# EAGLE design microSD_Shield (EAGLE 6.5.0)
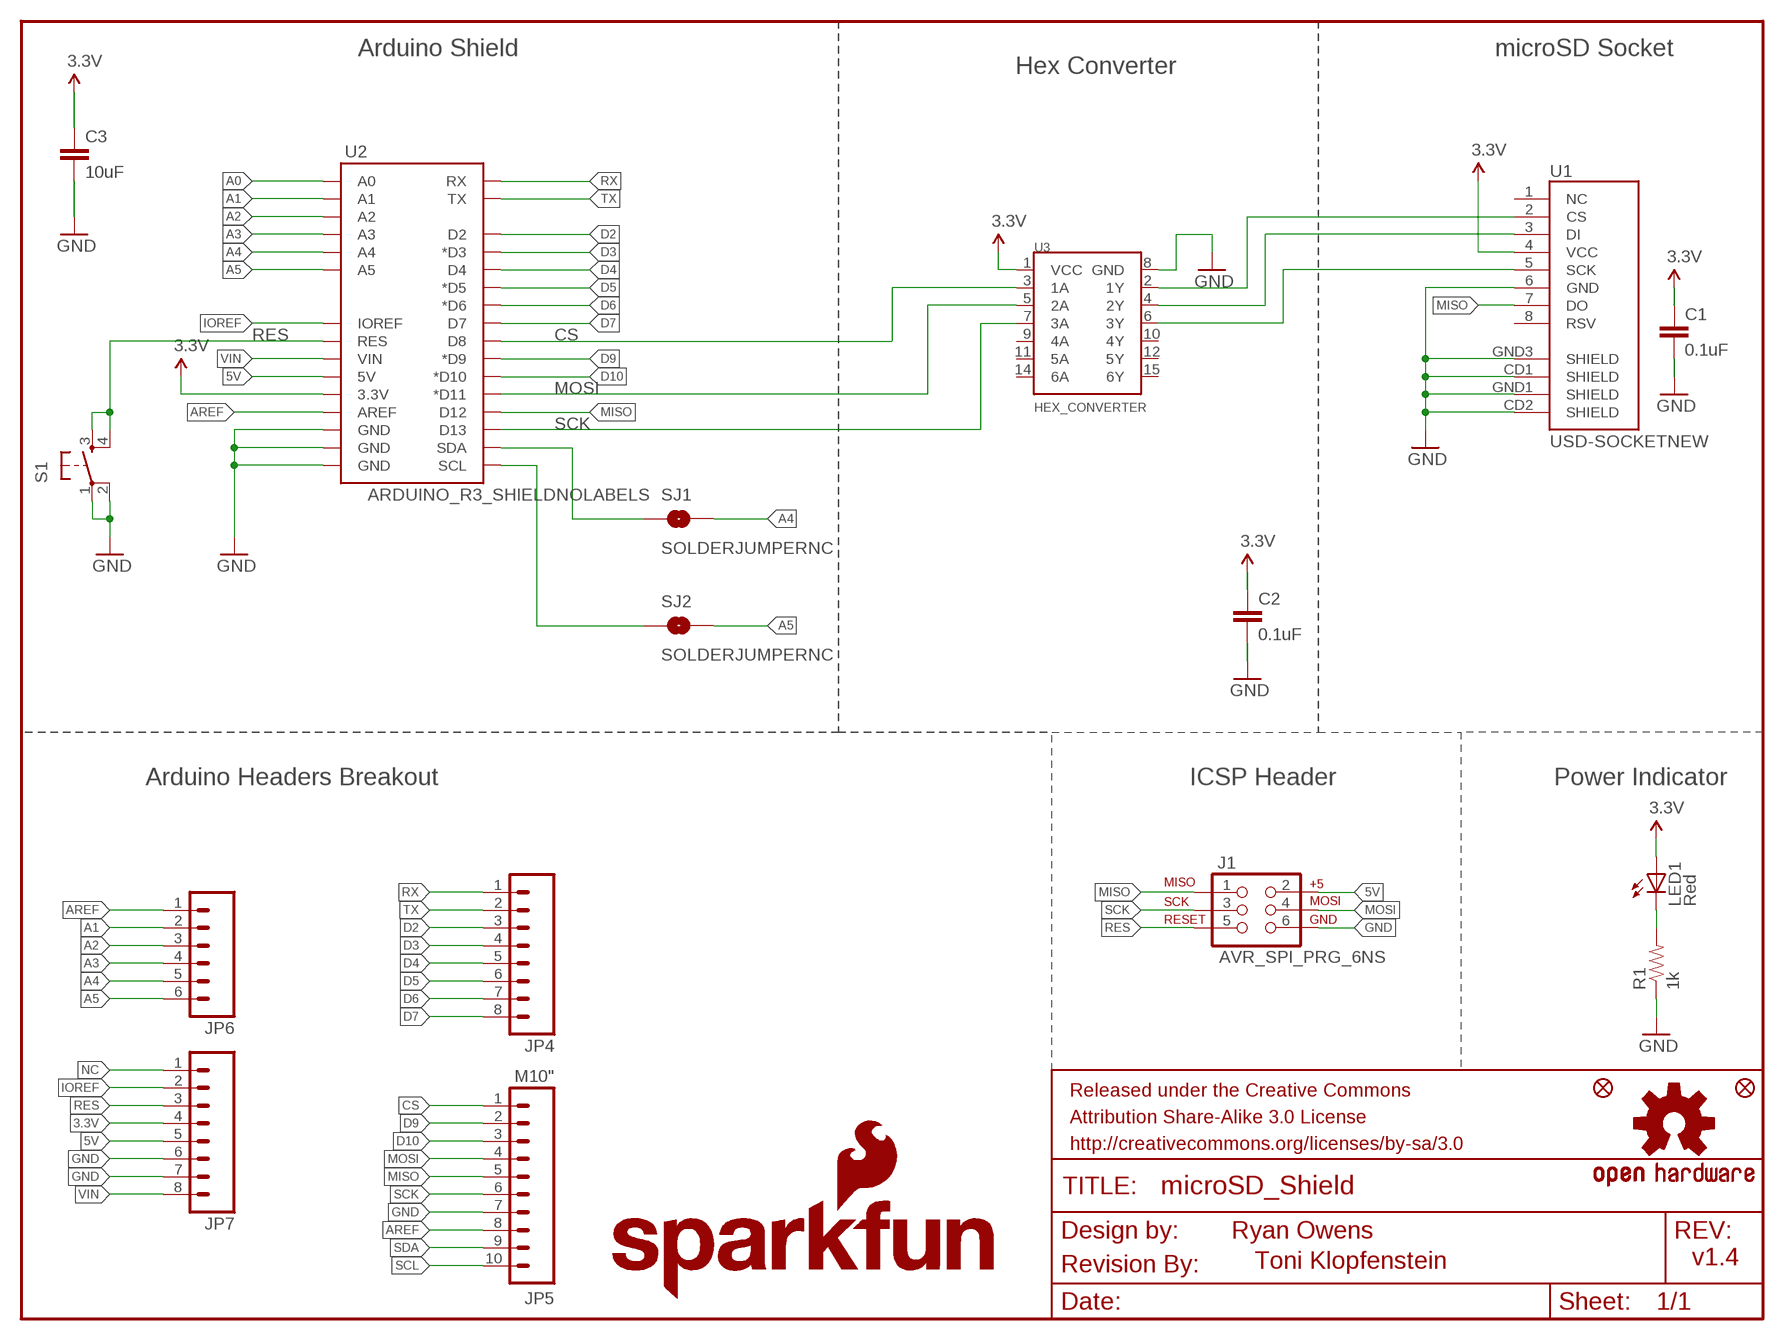
[diagram p0: schematic, sheet 1]

## Parts
C1  0.1uF  0.1UF-25V-5%(0603)  [0603-CAP]
C2  0.1uF  0.1UF-25V-5%(0603)  [0603-CAP]
C3  10uF  10UF-6.3V-20%(0603)  [0603-CAP]
FRAME1  FRAME-LETTER  [CREATIVE_COMMONS]
J1  AVR_SPI_PRG_6NS  [2X3-NS]
JP1  SFE_LOGO_NAME_FLAME.1_INCH  [SFE_LOGO_NAME_FLAME_.1]
JP2  FIDUCIAL1X2  [FIDUCIAL-1X2]
JP3  FIDUCIAL1X2  [FIDUCIAL-1X2]
JP4  M08  [1X08]
JP5  M10"  [1X10]
JP6  M06SIP  [1X06]
JP7  M081X08  [1X08]
LED1  Red  LED0603  [LED-0603]
LOGO1  OSHW-LOGOM  [OSHW-LOGO-M]
LOGO2  SFE_LOGO_FLAME.6_INCH  [SFE_LOGO_FLAME_.6]
R1  1k  RESISTOR0603-RES  [0603-RES]
S1  TAC_SWITCHSMD  [TACTILE_SWITCH_SMD]
SJ1  SOLDERJUMPERNC  [SJ_2S]
SJ2  SOLDERJUMPERNC  [SJ_2S]
U1  USD-SOCKETNEW  [MICRO-SD-SOCKET-PP]
U2  ARDUINO_R3_SHIELDNOLABELS  [UNO_R3_SHIELD_NOLABELS]
U3  HEX_CONVERTER  [SO016]
U$1  REVISION  [REVISION]

## Nets
3.3V: C1.1 C2.1 C3.1 JP7.4 LED1.A U1.4(VCC) U2.3.3V U3.1(VCC)
5V: J1.2 JP7.5 U2.5V
A0: JP6.1 U2.A0
A1: JP6.2 U2.A1
A2: JP6.3 U2.A2
A3: JP6.4 U2.A3
A4: JP6.5 SJ1.2 U2.A4
A5: JP6.6 SJ2.2 U2.A5
AREF: JP5.8 U2.AREF
CS: JP5.1 U2.D8 U3.3(1A)
D2: JP4.3 U2.D2
D3: JP4.4 U2.D3(*D3)
D4: JP4.5 U2.D4
D5: JP4.6 U2.D5(*D5)
D6: JP4.7 U2.D6(*D6)
D7: JP4.8 U2.D7
D9: JP5.2 U2.D9(*D9)
D10: JP5.3 U2.D10(*D10)
GND: C1.2 C2.2 C3.2 J1.6 JP5.7 JP7.6 JP7.7 R1.1 S1.1 S1.2 U1.6(GND) U1.CD1(SHIELD) U1.CD2(SHIELD) U1.GND1(SHIELD) U1.GND3(SHIELD) U2.GND@0(GND) U2.GND@1(GND) U2.GND@2(GND) U3.8(GND)
IOREF: JP7.2 U2.IOREF
MISO: J1.1 JP5.5 U1.7(DO) U2.D12
MOSI: J1.4 JP5.4 U2.D11(*D11) U3.5(2A)
N$2: U1.3(DI) U3.4(2Y)
N$4: U1.5(SCK) U3.6(3Y)
N$6: LED1.C R1.2
N$163: U1.2(CS) U3.2(1Y)
NC: JP7.1
RES: J1.5 JP7.3 S1.3 S1.4 U2.RES
RX: JP4.1 U2.RX
SCK: J1.3 JP5.6 U2.D13 U3.7(3A)
SCL: JP5.10 SJ2.1 U2.SCL
SDA: JP5.9 SJ1.1 U2.SDA
TX: JP4.2 U2.TX
VIN: JP7.8 U2.VIN
Unconnected: U1.1(NC) U1.8(RSV) U3.9(4A) U3.10(4Y) U3.11(5A) U3.12(5Y) U3.14(6A) U3.15(6Y)

## Notes on the sheet
- Arduino Shield | microSD Socket
- Hex Converter
- ICSP Header | Power Indicator
- Arduino Headers Breakout
- Ryan Owens
- Toni Klopfenstein | v1.4

## Library data of the parts
C1 C2 = SparkFun-Capacitors:0.1UF-25V-5%(0603): CAP-08604; PROD_ID: CAP-08604
C3 = SparkFun-Capacitors:10UF-6.3V-20%(0603): CAP-11015; PROD_ID: CAP-11015
FRAME1 = SparkFun-Aesthetics:FRAME-LETTER: Schematic Frame Standard 8.5x11 US Letter frame
J1 = SparkFun-Connectors:AVR_SPI_PRG_6: AVR ISP 6 Pin This is the reduced ISP connector for AVR programming. Common on Arduino. This footprint will take up less PCB space and can be used with a 10-pin to 6-pin adapter such as SKU: BOB-08508
JP1 = SparkFun-Aesthetics:SFE_LOGO_NAME_FLAME: SFE Logo, name and flame This is the SparkFun full logo. The logo on the schematic will always be the same size; the package variant is the height of the flame part of the logo. Default layer for the logo on the board is tSilk.
JP2 JP3 = SparkFun-Aesthetics:FIDUCIAL: Fiducial Alignment Points Various fiducial points for machine vision alignment.
JP4 = SparkFun:M08: Header 8 Standard 8-pin 0.1" header. Use with straight break away headers (SKU : PRT-00116), right angle break away headers (PRT-00553), swiss pins (PRT-00743), machine pins (PRT-00117), and female headers (PRT-00115).
JP5 = SparkFun-Connectors:M10: Header 10 Standard 10-pin 0.1" header. Use with straight break away headers (SKU : PRT-00116), right angle break away headers (PRT-00553), swiss pins (PRT-00743), machine pins (PRT-00117), and female headers (PRT-00115).
JP6 = SparkFun:M06: Header 6 Standard 6-pin 0.1" header. Use with straight break away headers (SKU : PRT-00116), right angle break away headers (PRT-00553), swiss pins (PRT-00743), machine pins (PRT-00117), and female headers (PRT-00115). Molex polarized connector foot print use with SKU : PRT-08094 with associated crimp pins and housings. NOTES ON THE VARIANTS LOCK and LOCK_LONGPADS... This footprint was designed to help hold the alignment of a through-hole component (i.e. 6-pin header) while soldering it into place. You may notice that each hole has been shifted either up or down by 0.005 of an inch from it's more standard position (which is a perfectly straight line). This slight alteration caused the pins (the squares in the middle) to touch the edges of the holes. Because they are alternating, it causes a "brace" to hold the component in place. 0.005 has proven to be the perfect amount of "off-center" position when using our standard breakaway headers. Although looks a little odd when you look at the bare footprint, once you have a header in there, the alteration is very hard to notice. Also, if you push a header all the way into place, it is covered up entirely on the bottom side. This idea of altering the position of holes to aid alignment will be further integrated into the Sparkfun Library for other footprints. It can help hold any component with 3 or more connection pins.
JP7 = SparkFun-Connectors:M08: Header 8 Standard 8-pin 0.1" header. Use with straight break away headers (SKU : PRT-00116), right angle break away headers (PRT-00553), swiss pins (PRT-00743), machine pins (PRT-00117), and female headers (PRT-00115).
LED1 = SparkFun:LED: LEDs Standard schematic elements and footprints for 5mm, 3mm, 1206, and 0603 sized LEDs. 5mm - Spark Fun Electronics SKU : COM-00529 (and others)
LOGO1 = SparkFun-Aesthetics:OSHW-LOGO: Open Source Hardware Logo This logo indicates the piece of hardware it is found on incorporates a OSHW license and/or adheres to the definition of open source hardware found here: http://freedomdefined.org/OSHW
LOGO2 = SparkFun-Aesthetics:SFE_LOGO_FLAME: SFE Logo, flame only This is the SparkFun flame logo. The logo on the schematic will always be the same size; the package variant is the height of the flame. Default layer for the logo on the board is tSilk.
R1 = SparkFun:RESISTOR: Resistor Basic schematic elements and footprints for 0603, 1206, and PTH 1/10th watt (small) resistors.
S1 = SparkFun:TAC_SWITCH: Momentary Switch Button commonly used for reset or general input. Spark Fun Electronics SKU : COM-00097
SJ1 SJ2 = SparkFun-Passives:SOLDERJUMPER: Solder Jumper Standard SMD solder jumper. Used to automate production. Two varients : Normally Open and Normally Closed are the same, but have different paste layers. NC will have a large amount of paste and should jumper during reflow.
U1 = SparkFun:USD-SOCKET: microSD Socket Push-push type uSD socket. Schematic element and footprint production proven. Spark Fun Electronics SKU : PRT-00127. tDoc lines correctly indicate media card edge positions when inserting (unlocked, locked, depressed).
U2 = SparkFun-Boards:ARDUINO_R3_SHIELD: Shield form compatible with the Arduino Uno R3.
U3 = SparkFun:HEX_CONVERTER
U$1 = SparkFun-Aesthetics:REVISION

## Board
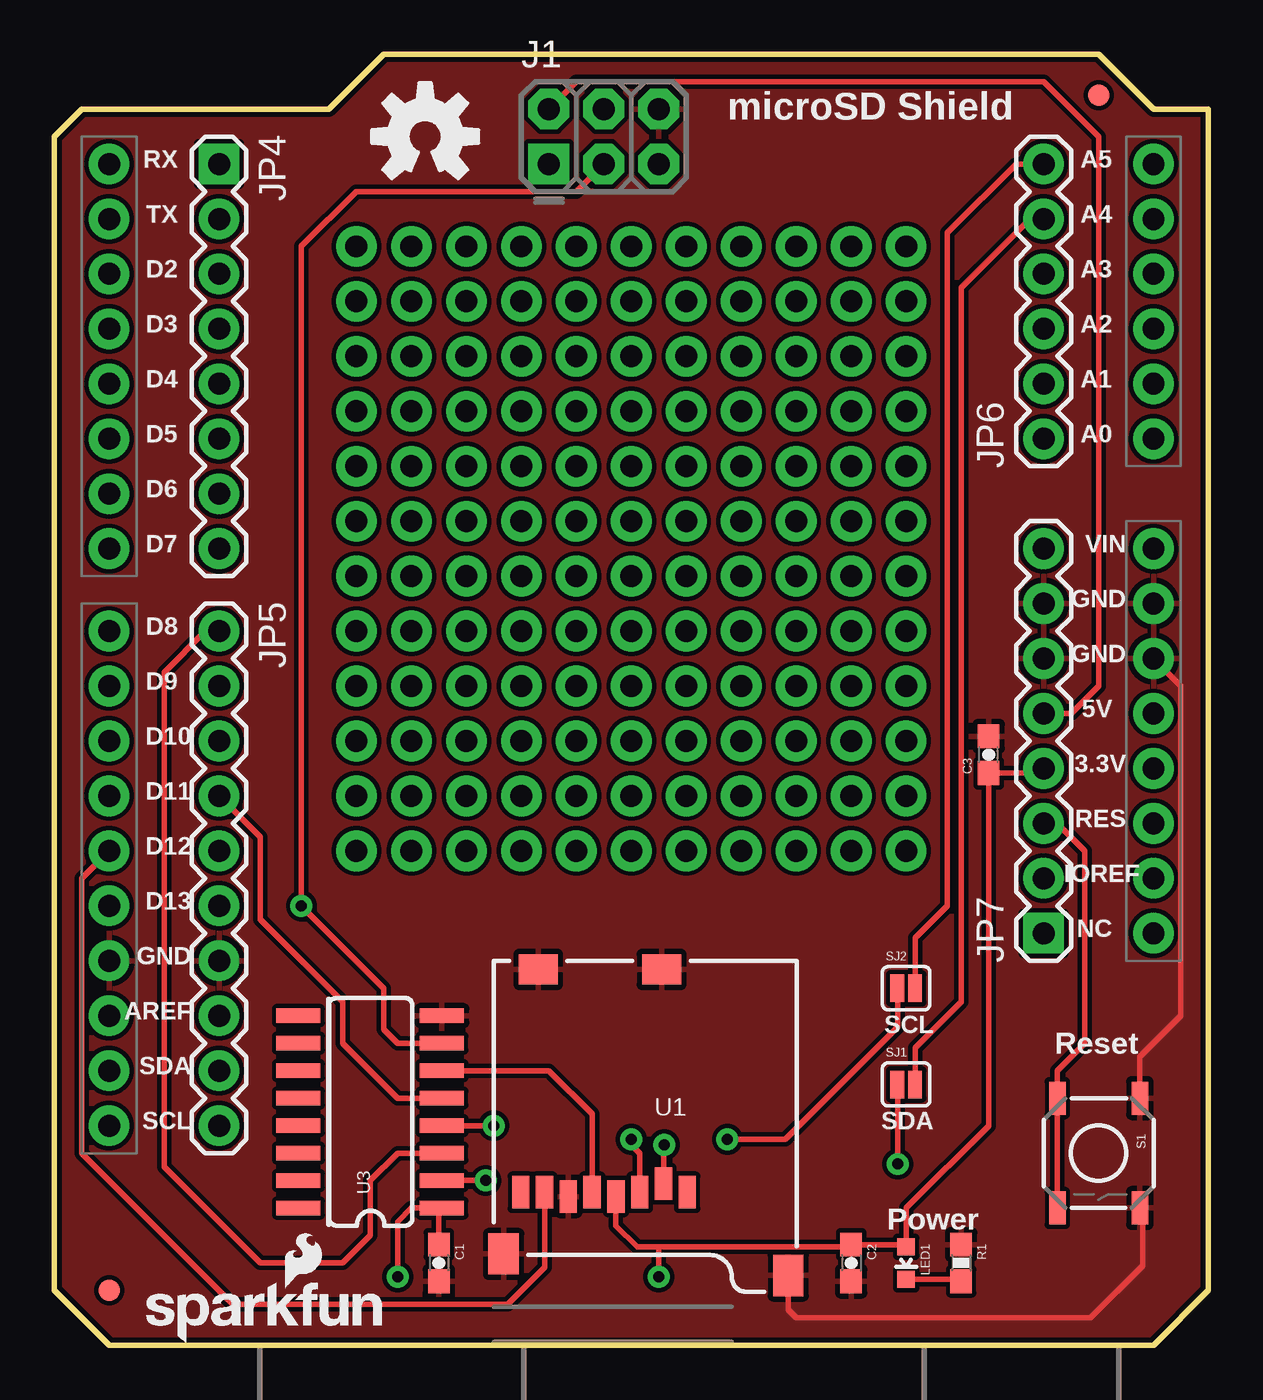
[diagram p1: board, top side]
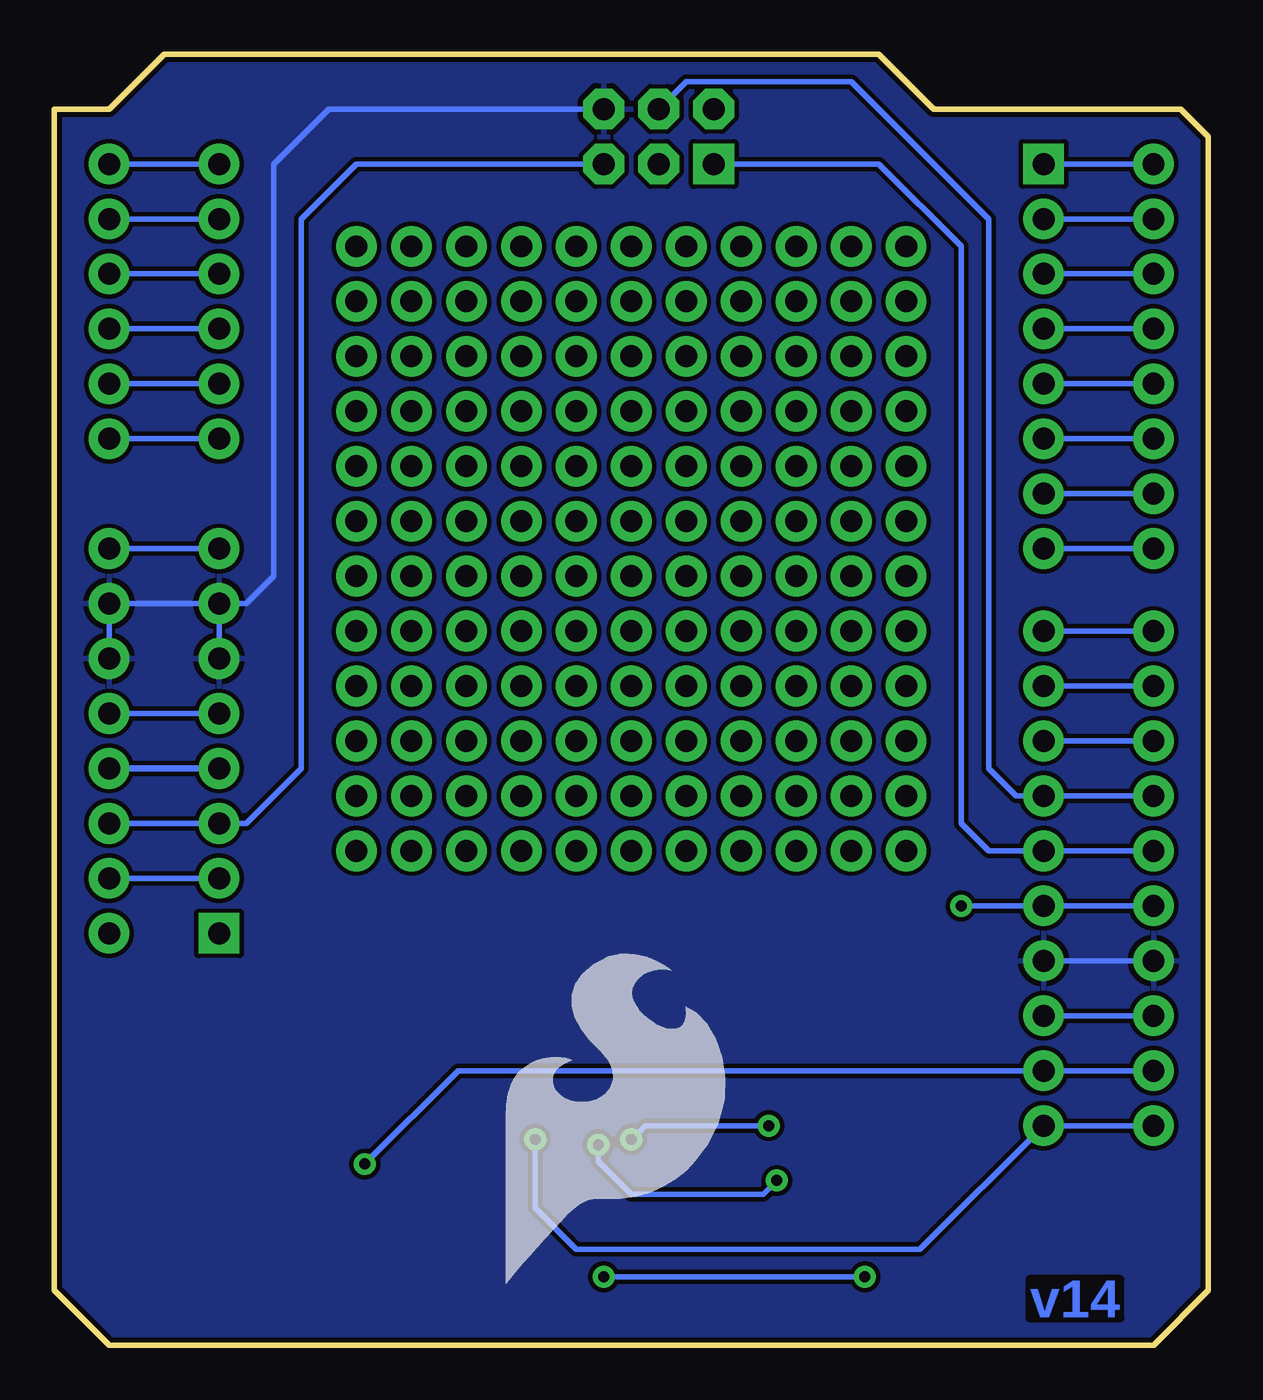
[diagram p2: board, bottom side, seen from below]

Size 53.34 x 59.69 mm. Coordinates in mm from the lower left corner, seen from the top.
Outline: 0,2.54 0,55.88 1.27,57.15 12.7,57.15 15.24,59.69 48.26,59.69 50.8,57.15 53.34,57.15 53.34,2.54 50.8,0 2.54,0 0,2.54
Copper layers (1*16): Top 0.035mm / dielectric 1.5mm / Bottom 0.035mm
Design rules "SparkFun *": minimum track width 8mil, minimum drill 20mil, track to track 8mil, track to pad 8mil, pad to pad 8mil, via to via 8mil, smd to smd 8mil, copper to edge 9mil, drill to drill 8mil, minimum pad ring 12mil, minimum via ring 10mil, stop-mask expansion 4mil, vias tented up to drill 20mil, thermal gap 10mil

### Footprints (pad centres in the part's own frame; a part is rotated, then mirrored left to right if it is on the bottom)
0603-CAP = smd 1.1 x 1: 1 -0.85,0; 2 0.85,0
2X3-NS = drill 1.016 pad 1.88 square: 1 -2.54,-1.27 | drill 1.016 pad 1.88 octagon: 2 -2.54,1.27; 3 0,-1.27; 4 0,1.27; 5 2.54,-1.27; 6 2.54,1.27
FIDUCIAL-1X2 = smd 1 x 1: 1 0,0
1X08 = drill 1.016 pad 1.88 square: 1 0,0 | drill 1.016 pad 1.88: 2 2.54,0; 3 5.08,0; 4 7.62,0; 5 10.16,0; 6 12.7,0; 7 15.24,0; 8 17.78,0
1X10 = drill 1.016 pad 1.88: 1 0,0; 2 2.54,0; 3 5.08,0; 4 7.62,0; 5 10.16,0; 6 12.7,0; 7 15.24,0; 8 17.78,0; 9 20.32,0; 10 22.86,0
1X06 = drill 1.016 pad 1.88: 1 0,0; 2 2.54,0; 3 5.08,0; 4 7.62,0; 5 10.16,0; 6 12.7,0
LED-0603 = smd 0.8 x 0.8: A 0,-0.75; C 0,0.75
0603-RES = smd 1.1 x 1: 1 -0.85,0; 2 0.85,0
TACTILE_SWITCH_SMD = smd 1.524 x 0.762: 1 -2.54,1.905; 2 2.54,1.905; 3 -2.54,-1.905; 4 2.54,-1.905
SJ_2S = smd 0.635 x 1.27: 1 -0.412,0; 2 0.412,0
MICRO-SD-SOCKET-PP = smd 0.8 x 1.5: 1 -8.94,10.7; 2 -7.84,10.3; 3 -6.74,10.7; 4 -5.64,10.9; 5 -4.54,10.7; 6 -3.44,10.9; 7 -2.34,10.7; 8 -1.24,10.7 | smd 1.8 x 1.4: CD1 -2.05,0.4; CD2 -7.75,0.4 | smd 1.4 x 1.9: GND1 -13.6,14.55; GND3 -0.45,13.55
UNO_R3_SHIELD_NOLABELS = drill 1.016 pad 1.88: 3.3V 50.8,26.67; 5V 50.8,29.21; A0 50.8,41.91; A1 50.8,44.45; A2 50.8,46.99; A3 50.8,49.53; A4 50.8,52.07; A5 50.8,54.61; AREF 2.54,15.24; D2 2.54,49.53; D3 2.54,46.99; D4 2.54,44.45; D5 2.54,41.91; D6 2.54,39.37; D7 2.54,36.83; D8 2.54,33.02; D9 2.54,30.48; D10 2.54,27.94; D11 2.54,25.4; D12 2.54,22.86; D13 2.54,20.32; GND@0 50.8,31.75; GND@1 50.8,34.29; GND@2 2.54,17.78; IOREF 50.8,21.59; NC 50.8,19.05; RES 50.8,24.13; RX 2.54,54.61; SCL 2.54,10.16; SDA 2.54,12.7; TX 2.54,52.07; VIN 50.8,36.83
SO016 = smd 0.66 x 2.032: 1 -4.445,-3.315; 2 -3.175,-3.315; 3 -1.905,-3.315; 4 -0.635,-3.315; 5 0.635,-3.315; 6 1.905,-3.315; 7 3.175,-3.315; 8 4.445,-3.315; 9 4.445,3.315; 10 3.175,3.315; 11 1.905,3.315; 12 0.635,3.315; 13 -0.635,3.315; 14 -1.905,3.315; 15 -3.175,3.315; 16 -4.445,3.315

### Placement (x,y rotation side)
C1  17.78,3.81 270 top
C2  36.83,3.81 270 top
C3  43.18,27.3 90 top
FRAME1  -5.82,-25.4 0 top  (outside the outline)
J1  25.4,55.88 0 top
JP1  3.81,0 0 top
JP2  48.26,57.78 0 top
JP3  2.54,2.54 0 top
JP4  7.62,54.61 270 top
JP5  7.62,33.02 270 top
JP6  45.72,41.91 90 top
JP7  45.72,19.05 90 top
LED1  39.37,3.81 180 top
LOGO1  17.14,55.88 0 top
LOGO2  33.02,2.54 0 bottom
R1  41.91,3.81 270 top
S1  48.26,8.89 270 top
SJ1  39.37,12.06 0 top
SJ2  39.37,16.51 0 top
U1  20.32,17.78 180 top
U2  0,0 0 top
U3  14.61,10.79 90 top
U$1  5.08,-27.94 0 top  (outside the outline)

### Tracks (layer width: path | path; a pad name or v marks a point on that pad's centre or on a via)
3.3V  (via drill 0.51)
  Top 0.254: U1.4 25.96,5.54 26.94,4.56 27.94,4.56 | v15.88,3.17 15.88,5.71 16.51,6.35 U3.1 17.78,6.21 C1.1 | v27.94,3.17 27.94,4.56 | 27.94,4.56 36.73,4.56 C2.1 39.27,4.66 LED1.A 39.37,6.35 43.18,10.16 C3.1 45.51,26.45 JP7.4
  Bottom 0.254: v15.88,3.17 v27.94,3.17
  Bottom 0.305: JP7.4 U2.3.3V
5V
  Top 0.254: JP7.5 46.99,29.21 48.26,30.48 48.26,55.88 45.72,58.42 24.13,58.42 J1.2
  Bottom 0.254: JP7.5 U2.5V
A0
  Bottom 0.254: JP6.1 U2.A0
A1
  Bottom 0.254: JP6.2 U2.A1
A2
  Bottom 0.254: JP6.3 U2.A2
A3
  Bottom 0.254: JP6.4 U2.A3
A4
  Top 0.254: SJ1.2 39.78,13.75 41.91,15.88 41.91,48.9 45.09,52.07 JP6.5
  Bottom 0.254: JP6.5 U2.A4
A5
  Top 0.254: JP6.6 44.45,54.61 41.28,51.44 41.28,20.32 39.78,18.83 SJ2.2
  Bottom 0.254: JP6.6 U2.A5
AREF
  Bottom 0.254: U2.AREF JP5.8
CS
  Top 0.254: JP5.1 6.98,33.02 5.08,31.11 5.08,8.26 9.53,3.81 10.16,3.81 10.79,3.81 13.33,3.81 14.61,5.08 14.61,7.62 15.88,8.89 U3.3
  Bottom 0.254: U2.D8 JP5.1
D2
  Bottom 0.254: U2.D2 JP4.3
D3
  Bottom 0.254: U2.D3 JP4.4
D4
  Bottom 0.254: U2.D4 JP4.5
D5
  Bottom 0.254: U2.D5 JP4.6
D6
  Bottom 0.254: U2.D6 JP4.7
D7
  Bottom 0.254: U2.D7 JP4.8
D9
  Bottom 0.254: U2.D9 JP5.2
D10
  Bottom 0.254: U2.D10 JP5.3
GND
  Top 0.254: U2.GND@0 52.07,30.48 52.07,15.24 50.17,13.34 S1.1 | U1.GND1 33.92,1.64 34.29,1.27 47.88,1.27 50.29,3.68 50.29,6.22 S1.2
  Bottom 0.254: U2.GND@0 U2.GND@1 46.36,34.29 | J1.6 40.64,57.15 43.18,54.61 43.18,35.56 44.45,34.29 JP7.7 46.36,34.29 | U2.GND@2 JP5.7 | JP7.6 45.72,33.66 46.36,34.29
  pour Bottom: 2.54,0 0,2.54 0,55.88 1.27,57.15 12.7,57.15 15.24,59.69 48.26,59.69 50.8,57.15 53.34,57.15 53.34,2.54 50.8,0
  pour Top: 2.54,0 0,2.54 0,55.88 1.27,57.15 12.7,57.15 15.24,59.69 48.26,59.69 50.8,57.15 53.34,57.15 53.34,2.54 50.8,0
IOREF
  Bottom 0.254: JP7.2 U2.IOREF
MISO
  Top 0.254: U1.7 22.66,3.61 20.95,1.91 8.26,1.91 1.27,8.89 1.27,21.59 U2.D12
  Bottom 0.254: JP5.5 U2.D12 10.16,22.86 11.43,24.13 11.43,50.8 15.24,54.61 J1.1
MOSI
  Top 0.254: U3.5 15.88,11.43 13.33,13.97 13.33,15.88 9.53,19.68 9.53,23.5 JP5.4
  Bottom 0.254: J1.4 24.13,58.42 16.51,58.42 10.16,52.07 10.16,26.67 8.89,25.4 JP5.4 U2.D11
N$2  (via drill 0.51)
  Top 0.254: U3.4 v20.32,10.16 | v26.67,9.53 26.67,9.27 27.05,8.89 U1.3
  Bottom 0.254: v20.32,10.16 26.04,10.16 v26.67,9.53
N$4
  Top 0.254: U3.6 22.86,12.7 24.86,10.7 U1.5
N$6
  Top 0.254: LED1.C 41.81,3.06 R1.2
N$7  (via drill 1.02 pad 1.88)
  other vias: 39.37,50.8
N$9  (via drill 1.02 pad 1.88)
  other vias: 36.83,50.8
N$10  (via drill 1.02 pad 1.88)
  other vias: 34.29,50.8
N$11  (via drill 1.02 pad 1.88)
  other vias: 31.75,50.8
N$12  (via drill 1.02 pad 1.88)
  other vias: 29.21,50.8
N$13  (via drill 1.02 pad 1.88)
  other vias: 26.67,50.8
N$14  (via drill 1.02 pad 1.88)
  other vias: 24.13,50.8
N$15  (via drill 1.02 pad 1.88)
  other vias: 21.59,50.8
N$16  (via drill 1.02 pad 1.88)
  other vias: 19.05,50.8
N$17  (via drill 1.02 pad 1.88)
  other vias: 16.51,50.8
N$18  (via drill 1.02 pad 1.88)
  other vias: 13.97,50.8
N$21  (via drill 1.02 pad 1.88)
  other vias: 13.97,48.26
N$22  (via drill 1.02 pad 1.88)
  other vias: 16.51,48.26
N$23  (via drill 1.02 pad 1.88)
  other vias: 19.05,48.26
N$24  (via drill 1.02 pad 1.88)
  other vias: 21.59,48.26
N$25  (via drill 1.02 pad 1.88)
  other vias: 24.13,48.26
N$26  (via drill 1.02 pad 1.88)
  other vias: 26.67,48.26
N$27  (via drill 1.02 pad 1.88)
  other vias: 29.21,48.26
N$28  (via drill 1.02 pad 1.88)
  other vias: 31.75,48.26
N$29  (via drill 1.02 pad 1.88)
  other vias: 34.29,48.26
N$30  (via drill 1.02 pad 1.88)
  other vias: 36.83,48.26
N$31  (via drill 1.02 pad 1.88)
  other vias: 39.37,48.26
N$34  (via drill 1.02 pad 1.88)
  other vias: 39.37,45.72
N$35  (via drill 1.02 pad 1.88)
  other vias: 36.83,45.72
N$36  (via drill 1.02 pad 1.88)
  other vias: 34.29,45.72
N$37  (via drill 1.02 pad 1.88)
  other vias: 31.75,45.72
N$38  (via drill 1.02 pad 1.88)
  other vias: 29.21,45.72
N$39  (via drill 1.02 pad 1.88)
  other vias: 26.67,45.72
N$40  (via drill 1.02 pad 1.88)
  other vias: 24.13,45.72
N$41  (via drill 1.02 pad 1.88)
  other vias: 21.59,45.72
N$42  (via drill 1.02 pad 1.88)
  other vias: 19.05,45.72
N$43  (via drill 1.02 pad 1.88)
  other vias: 16.51,45.72
N$44  (via drill 1.02 pad 1.88)
  other vias: 13.97,45.72
N$47  (via drill 1.02 pad 1.88)
  other vias: 13.97,43.18
N$48  (via drill 1.02 pad 1.88)
  other vias: 16.51,43.18
N$49  (via drill 1.02 pad 1.88)
  other vias: 19.05,43.18
N$50  (via drill 1.02 pad 1.88)
  other vias: 21.59,43.18
N$51  (via drill 1.02 pad 1.88)
  other vias: 24.13,43.18
N$52  (via drill 1.02 pad 1.88)
  other vias: 26.67,43.18
N$53  (via drill 1.02 pad 1.88)
  other vias: 29.21,43.18
N$54  (via drill 1.02 pad 1.88)
  other vias: 31.75,43.18
N$55  (via drill 1.02 pad 1.88)
  other vias: 34.29,43.18
N$56  (via drill 1.02 pad 1.88)
  other vias: 36.83,43.18
N$57  (via drill 1.02 pad 1.88)
  other vias: 39.37,43.18
N$60  (via drill 1.02 pad 1.88)
  other vias: 39.37,40.64
N$61  (via drill 1.02 pad 1.88)
  other vias: 36.83,40.64
N$62  (via drill 1.02 pad 1.88)
  other vias: 34.29,40.64
N$63  (via drill 1.02 pad 1.88)
  other vias: 31.75,40.64
N$64  (via drill 1.02 pad 1.88)
  other vias: 29.21,40.64
N$65  (via drill 1.02 pad 1.88)
  other vias: 26.67,40.64
N$66  (via drill 1.02 pad 1.88)
  other vias: 24.13,40.64
N$67  (via drill 1.02 pad 1.88)
  other vias: 21.59,40.64
N$68  (via drill 1.02 pad 1.88)
  other vias: 19.05,40.64
N$69  (via drill 1.02 pad 1.88)
  other vias: 16.51,40.64
N$70  (via drill 1.02 pad 1.88)
  other vias: 13.97,40.64
N$73  (via drill 1.02 pad 1.88)
  other vias: 13.97,38.1
N$74  (via drill 1.02 pad 1.88)
  other vias: 16.51,38.1
N$75  (via drill 1.02 pad 1.88)
  other vias: 19.05,38.1
N$76  (via drill 1.02 pad 1.88)
  other vias: 21.59,38.1
N$77  (via drill 1.02 pad 1.88)
  other vias: 24.13,38.1
N$78  (via drill 1.02 pad 1.88)
  other vias: 26.67,38.1
N$79  (via drill 1.02 pad 1.88)
  other vias: 29.21,38.1
N$80  (via drill 1.02 pad 1.88)
  other vias: 31.75,38.1
N$81  (via drill 1.02 pad 1.88)
  other vias: 34.29,38.1
N$82  (via drill 1.02 pad 1.88)
  other vias: 36.83,38.1
N$83  (via drill 1.02 pad 1.88)
  other vias: 39.37,38.1
N$86  (via drill 1.02 pad 1.88)
  other vias: 39.37,35.56
N$87  (via drill 1.02 pad 1.88)
  other vias: 36.83,35.56
N$88  (via drill 1.02 pad 1.88)
  other vias: 34.29,35.56
N$89  (via drill 1.02 pad 1.88)
  other vias: 31.75,35.56
N$90  (via drill 1.02 pad 1.88)
  other vias: 29.21,35.56
N$91  (via drill 1.02 pad 1.88)
  other vias: 26.67,35.56
N$92  (via drill 1.02 pad 1.88)
  other vias: 24.13,35.56
N$93  (via drill 1.02 pad 1.88)
  other vias: 21.59,35.56
N$94  (via drill 1.02 pad 1.88)
  other vias: 19.05,35.56
N$95  (via drill 1.02 pad 1.88)
  other vias: 16.51,35.56
N$96  (via drill 1.02 pad 1.88)
  other vias: 13.97,35.56
N$99  (via drill 1.02 pad 1.88)
  other vias: 13.97,33.02
N$100  (via drill 1.02 pad 1.88)
  other vias: 16.51,33.02
N$101  (via drill 1.02 pad 1.88)
  other vias: 19.05,33.02
N$102  (via drill 1.02 pad 1.88)
  other vias: 21.59,33.02
N$103  (via drill 1.02 pad 1.88)
  other vias: 24.13,33.02
N$104  (via drill 1.02 pad 1.88)
  other vias: 26.67,33.02
N$105  (via drill 1.02 pad 1.88)
  other vias: 29.21,33.02
N$106  (via drill 1.02 pad 1.88)
  other vias: 31.75,33.02
N$107  (via drill 1.02 pad 1.88)
  other vias: 34.29,33.02
N$108  (via drill 1.02 pad 1.88)
  other vias: 36.83,33.02
N$109  (via drill 1.02 pad 1.88)
  other vias: 39.37,33.02
N$112  (via drill 1.02 pad 1.88)
  other vias: 39.37,30.48
N$113  (via drill 1.02 pad 1.88)
  other vias: 36.83,30.48
N$114  (via drill 1.02 pad 1.88)
  other vias: 34.29,30.48
N$115  (via drill 1.02 pad 1.88)
  other vias: 31.75,30.48
N$116  (via drill 1.02 pad 1.88)
  other vias: 29.21,30.48
N$117  (via drill 1.02 pad 1.88)
  other vias: 26.67,30.48
N$118  (via drill 1.02 pad 1.88)
  other vias: 24.13,30.48
N$119  (via drill 1.02 pad 1.88)
  other vias: 21.59,30.48
N$120  (via drill 1.02 pad 1.88)
  other vias: 19.05,30.48
N$121  (via drill 1.02 pad 1.88)
  other vias: 16.51,30.48
N$122  (via drill 1.02 pad 1.88)
  other vias: 13.97,30.48
N$125  (via drill 1.02 pad 1.88)
  other vias: 13.97,27.94
N$126  (via drill 1.02 pad 1.88)
  other vias: 16.51,27.94
N$127  (via drill 1.02 pad 1.88)
  other vias: 19.05,27.94
N$128  (via drill 1.02 pad 1.88)
  other vias: 21.59,27.94
N$129  (via drill 1.02 pad 1.88)
  other vias: 24.13,27.94
N$130  (via drill 1.02 pad 1.88)
  other vias: 26.67,27.94
N$131  (via drill 1.02 pad 1.88)
  other vias: 29.21,27.94
N$132  (via drill 1.02 pad 1.88)
  other vias: 31.75,27.94
N$133  (via drill 1.02 pad 1.88)
  other vias: 34.29,27.94
N$134  (via drill 1.02 pad 1.88)
  other vias: 36.83,27.94
N$135  (via drill 1.02 pad 1.88)
  other vias: 39.37,27.94
N$138  (via drill 1.02 pad 1.88)
  other vias: 39.37,25.4
N$139  (via drill 1.02 pad 1.88)
  other vias: 36.83,25.4
N$140  (via drill 1.02 pad 1.88)
  other vias: 34.29,25.4
N$141  (via drill 1.02 pad 1.88)
  other vias: 31.75,25.4
N$142  (via drill 1.02 pad 1.88)
  other vias: 29.21,25.4
N$143  (via drill 1.02 pad 1.88)
  other vias: 26.67,25.4
N$144  (via drill 1.02 pad 1.88)
  other vias: 24.13,25.4
N$145  (via drill 1.02 pad 1.88)
  other vias: 21.59,25.4
N$146  (via drill 1.02 pad 1.88)
  other vias: 19.05,25.4
N$147  (via drill 1.02 pad 1.88)
  other vias: 16.51,25.4
N$148  (via drill 1.02 pad 1.88)
  other vias: 13.97,25.4
N$151  (via drill 1.02 pad 1.88)
  other vias: 13.97,22.86
N$152  (via drill 1.02 pad 1.88)
  other vias: 16.51,22.86
N$153  (via drill 1.02 pad 1.88)
  other vias: 19.05,22.86
N$154  (via drill 1.02 pad 1.88)
  other vias: 21.59,22.86
N$155  (via drill 1.02 pad 1.88)
  other vias: 24.13,22.86
N$156  (via drill 1.02 pad 1.88)
  other vias: 26.67,22.86
N$157  (via drill 1.02 pad 1.88)
  other vias: 29.21,22.86
N$158  (via drill 1.02 pad 1.88)
  other vias: 31.75,22.86
N$159  (via drill 1.02 pad 1.88)
  other vias: 34.29,22.86
N$160  (via drill 1.02 pad 1.88)
  other vias: 36.83,22.86
N$161  (via drill 1.02 pad 1.88)
  other vias: 39.37,22.86
N$163  (via drill 0.51)
  Top 0.254: U1.2 28.16,9.24 v28.19,9.27 | v19.94,7.62 U3.2
  Bottom 0.254: v28.19,9.27 28.19,8.51 26.67,6.99 20.57,6.99 v19.94,7.62
RES
  Top 0.254: S1.4 S1.3 46.36,12.7 47.62,13.97 47.62,22.86 46.36,24.13 JP7.3
  Bottom 0.254: J1.5 39.37,54.61 41.91,52.07 41.91,26.67 44.45,24.13 JP7.3 U2.RES
RX
  Bottom 0.254: U2.RX 6.35,54.61 JP4.1
SCK  (via drill 0.51)
  Top 0.254: J1.3 24.13,53.34 13.97,53.34 11.43,50.8 v11.43,20.32 15.24,16.51 15.24,14.61 15.88,13.97 U3.7
  Bottom 0.254: U2.D13 JP5.6 v11.43,20.32
SCL  (via drill 0.51)
  Top 0.254: v31.11,9.53 33.78,9.53 38.99,14.73 38.99,16.48 SJ2.1
  Bottom 0.254: U2.SCL JP5.10 13.33,4.45 29.21,4.45 31.11,6.35 v31.11,9.53
SDA  (via drill 0.51)
  Top 0.254: v38.99,8.38 38.99,12.03 SJ1.1
  Bottom 0.254: U2.SDA JP5.9 34.67,12.7 v38.99,8.38
TX
  Bottom 0.254: U2.TX JP4.2
VIN
  Bottom 0.254: U2.VIN JP7.8

### Text on the board
Bottom: v14
tPlace: microSD Shield | RX | A5 | TX | A4 | D2 | A3 | D3 | A2 | D4 | A1 | D5 | A0 | D6 | D7 | VIN | GND | D8 | GND | D9 | 5V | D10 | 3.3V | D11 | RES | D12 | IOREF | D13 | NC | GND | AREF | SCL | SDA | Reset | SCL | SDA | Power
tDocu: Ryan Owens | Toni Klopfenstein